# Altium schematic sheet ESC.SchDoc
size A
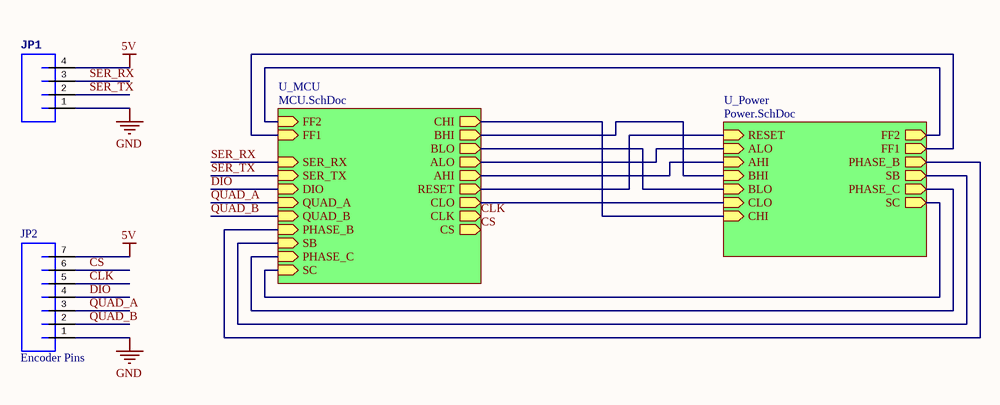
[diagram p0: ESC.SchDoc]

## Parts
JP1  (no value)  [JST-4-PTH-VERT]
JP2  Encoder Pins  [JST-7-PTH-VERT]

## Sub-sheets
U_MCU = MCU.SchDoc: CHI (out), BHI (out), BLO (out), FF2 (in), FF1 (in), ALO (out), AHI (out), RESET (out), CLO (out), SER_RX (in), SER_TX (in), DIO (in), CLK (out), CS (out), QUAD_A (in), QUAD_B (in), SC (in), PHASE_C (in), PHASE_B (in), SB (in)
U_Power = Power.SchDoc: RESET (in), FF2 (out), ALO (in), FF1 (out), AHI (in), BHI (in), BLO (in), CLO (in), CHI (in), PHASE_C (out), SC (out), PHASE_B (out), SB (out)

## Nets
5V: JP1.4 JP2.7
GND: JP1.1 JP2.1
CLK: JP2.5 ; sheet U_MCU/CLK
CS: JP2.6 ; sheet U_MCU/CS
DIO: JP2.4 ; sheet U_MCU/DIO
QUAD_A: JP2.3 ; sheet U_MCU/QUAD_A
QUAD_B: JP2.2 ; sheet U_MCU/QUAD_B
SER_RX: JP1.3 ; sheet U_MCU/SER_RX
SER_TX: JP1.2 ; sheet U_MCU/SER_TX
(unnamed): sheet U_MCU/CHI, sheet U_Power/CHI
(unnamed): sheet U_MCU/BHI, sheet U_Power/BHI
(unnamed): sheet U_MCU/BLO, sheet U_Power/BLO
(unnamed): sheet U_MCU/FF2, sheet U_Power/FF2
(unnamed): sheet U_MCU/FF1, sheet U_Power/FF1
(unnamed): sheet U_MCU/ALO, sheet U_Power/ALO
(unnamed): sheet U_MCU/AHI, sheet U_Power/AHI
(unnamed): sheet U_MCU/RESET, sheet U_Power/RESET
(unnamed): sheet U_MCU/CLO, sheet U_Power/CLO
(unnamed): sheet U_MCU/SC, sheet U_Power/SC
(unnamed): sheet U_MCU/PHASE_C, sheet U_Power/PHASE_C
(unnamed): sheet U_MCU/PHASE_B, sheet U_Power/PHASE_B
(unnamed): sheet U_MCU/SB, sheet U_Power/SB

## Library data of the parts
JP1 = JST_4_VERT
JP2 = JST_7_VERT